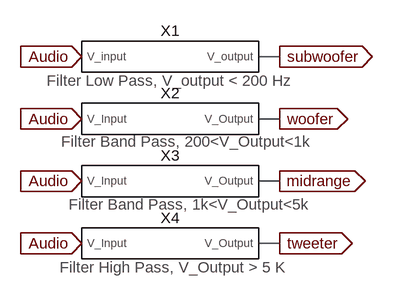
[diagram p0: schematic Crossover.asc]
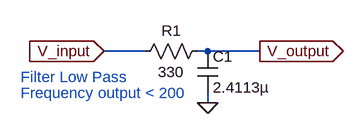
[diagram p1: sub-circuit low_pass_200.asc]
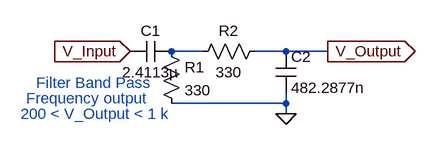
[diagram p2: sub-circuit band_pass_200_1k.asc]
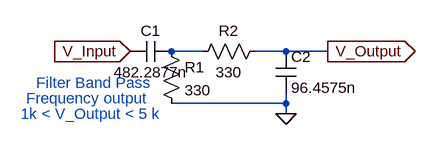
[diagram p3: sub-circuit band_pass_1k_5k.asc]
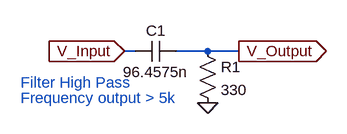
[diagram p4: sub-circuit high_pass_5k.asc]
Crossover.asc, the LTspice schematic file:
Version 4
SHEET 1 880 680
WIRE 352 16 320 16
WIRE 352 112 320 112
WIRE 352 208 320 208
WIRE 352 304 320 304
FLAG 48 16 Audio
IOPIN 48 16 In
FLAG 48 112 Audio
IOPIN 48 112 In
FLAG 48 208 Audio
IOPIN 48 208 In
FLAG 48 304 Audio
IOPIN 48 304 In
FLAG 352 16 subwoofer
IOPIN 352 16 Out
FLAG 352 112 woofer
IOPIN 352 112 Out
FLAG 352 208 midrange
IOPIN 352 208 Out
FLAG 352 304 tweeter
IOPIN 352 304 Out
SYMBOL Low_Pass_200 176 16 R0
SYMATTR InstName X1
SYMBOL Band_Pass_200_1k 176 112 R0
SYMATTR InstName X2
SYMBOL Band_Pass_1k_5K 176 208 R0
SYMATTR InstName X3
SYMBOL High_Pass_5k 176 304 R0
SYMATTR InstName X4

low_pass_200.asc, the sub-circuit schematic file:
Version 4
SHEET 1 880 680
WIRE 16 80 -48 80
WIRE 112 80 96 80
WIRE 192 80 112 80
WIRE 112 160 112 144
FLAG -48 80 V_input
IOPIN -48 80 In
FLAG 112 160 0
FLAG 192 80 V_output
IOPIN 192 80 Out
SYMBOL res 112 64 R90
WINDOW 0 0 56 VBottom 2
WINDOW 3 32 56 VTop 2
SYMATTR InstName R1
SYMATTR Value 330
SYMBOL cap 96 80 R0
SYMATTR InstName C1
SYMATTR Value 2.4113µ
TEXT -176 120 Left 2 ;Filter Low Pass
TEXT -176 144 Left 2 ;Frequency output < 200

band_pass_200_1k.asc, the sub-circuit schematic file:
Version 4
SHEET 1 880 680
WIRE 64 112 16 112
WIRE 192 112 144 112
WIRE 256 112 192 112
WIRE 192 192 192 176
WIRE 192 192 16 192
WIRE 192 208 192 192
FLAG -48 112 V_Input
IOPIN -48 112 In
FLAG 256 112 V_Output
IOPIN 256 112 Out
FLAG 192 208 0
SYMBOL cap 16 96 R90
WINDOW 0 0 32 VBottom 2
WINDOW 3 32 32 VTop 2
SYMATTR InstName C1
SYMATTR Value 2.4113µ
SYMBOL res 0 96 R0
SYMATTR InstName R1
SYMATTR Value 330
SYMBOL res 160 96 R90
WINDOW 0 0 56 VBottom 2
WINDOW 3 32 56 VTop 2
SYMATTR InstName R2
SYMATTR Value 330
SYMBOL cap 176 112 R0
SYMATTR InstName C2
SYMATTR Value 482.2877n
TEXT -192 160 Left 2 ;Filter Band Pass
TEXT -208 184 Left 2 ;Frequency output
TEXT -216 208 Left 2 ;200 < V_Output < 1 k

band_pass_1k_5k.asc, the sub-circuit schematic file:
Version 4
SHEET 1 880 680
WIRE 176 128 128 128
WIRE 304 128 256 128
WIRE 368 128 304 128
WIRE 304 208 304 192
WIRE 304 208 128 208
WIRE 304 224 304 208
FLAG 64 128 V_Input
IOPIN 64 128 In
FLAG 368 128 V_Output
IOPIN 368 128 Out
FLAG 304 224 0
SYMBOL cap 128 112 R90
WINDOW 0 0 32 VBottom 2
WINDOW 3 32 32 VTop 2
SYMATTR InstName C1
SYMATTR Value 482.2877n
SYMBOL res 112 112 R0
SYMATTR InstName R1
SYMATTR Value 330
SYMBOL res 272 112 R90
WINDOW 0 0 56 VBottom 2
WINDOW 3 32 56 VTop 2
SYMATTR InstName R2
SYMATTR Value 330
SYMBOL cap 288 128 R0
SYMATTR InstName C2
SYMATTR Value 96.4575n
TEXT -80 176 Left 2 ;Filter Band Pass
TEXT -96 200 Left 2 ;Frequency output
TEXT -104 224 Left 2 ;1k < V_Output < 5 k

high_pass_5k.asc, the sub-circuit schematic file:
Version 4
SHEET 1 880 680
WIRE 32 160 16 160
WIRE 144 160 96 160
WIRE 192 160 144 160
FLAG 16 160 V_Input
IOPIN 16 160 In
FLAG 144 240 0
FLAG 192 160 V_Output
IOPIN 192 160 Out
SYMBOL cap 96 144 R90
WINDOW 0 0 32 VBottom 2
WINDOW 3 32 32 VTop 2
SYMATTR InstName C1
SYMATTR Value 96.4575n
SYMBOL res 128 144 R0
SYMATTR InstName R1
SYMATTR Value 330
TEXT -144 208 Left 2 ;Filter High Pass
TEXT -144 232 Left 2 ;Frequency output > 5k

The netlist it stands for:
* Crossover.asc
XX1 Audio subwoofer low_pass_200
XX2 Audio woofer band_pass_200_1k
XX3 Audio midrange band_pass_1k_5k
XX4 Audio tweeter high_pass_5k

* block symbol definitions
.subckt low_pass_200 V_input V_output
R1 V_output V_input 330
C1 V_output 0 2.4113µ
* Filter Low Pass
* Frequency output < 200
.ends low_pass_200

.subckt band_pass_200_1k V_Input V_Output
C1 N001 V_Input 2.4113µ
R1 N001 0 330
R2 V_Output N001 330
C2 V_Output 0 482.2877n
* Filter Band Pass
* Frequency output
* 200 < V_Output < 1 k
.ends band_pass_200_1k

.subckt band_pass_1k_5k V_Input V_Output
C1 N001 V_Input 482.2877n
R1 N001 0 330
R2 V_Output N001 330
C2 V_Output 0 96.4575n
* Filter Band Pass
* Frequency output
* 1k < V_Output < 5 k
.ends band_pass_1k_5k

.subckt high_pass_5k V_Input V_Output
C1 V_Output V_Input 96.4575n
R1 V_Output 0 330
* Filter High Pass
* Frequency output > 5k
.ends high_pass_5k

.backanno
.end